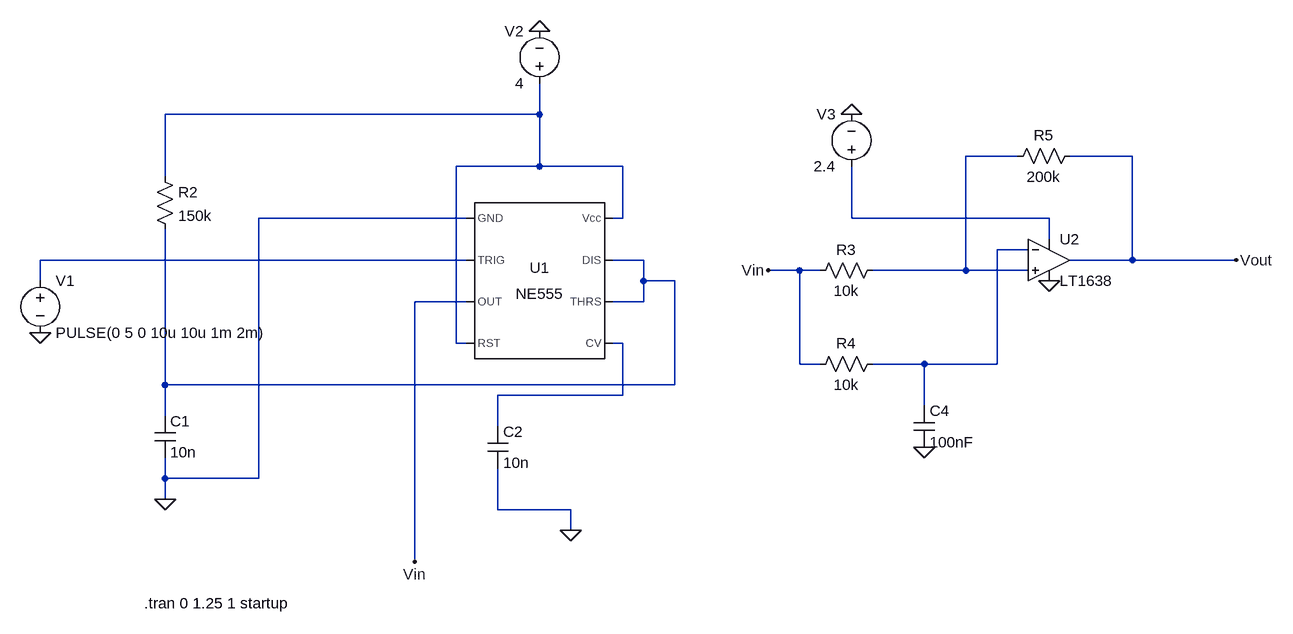
[diagram p0: schematic F to V using 555 Timer.asc]
F to V using 555 Timer.asc, the LTspice schematic file:
Version 4
SHEET 1 1368 804
WIRE 224 -80 224 -128
WIRE 224 -80 -352 -80
WIRE 960 -16 880 -16
WIRE 1136 -16 1040 -16
WIRE 224 0 224 -80
WIRE 224 0 96 0
WIRE 352 0 224 0
WIRE -352 16 -352 -80
WIRE 112 80 -208 80
WIRE 352 80 352 0
WIRE 352 80 336 80
WIRE 704 80 704 0
WIRE 1008 80 704 80
WIRE 1008 112 1008 80
WIRE 976 128 928 128
WIRE 112 144 -544 144
WIRE 384 144 336 144
WIRE 1136 144 1136 -16
WIRE 1136 144 1040 144
WIRE 1296 144 1136 144
WIRE 624 160 576 160
WIRE 656 160 624 160
WIRE 880 160 880 -16
WIRE 880 160 736 160
WIRE 976 160 880 160
WIRE -544 176 -544 144
WIRE 384 176 384 144
WIRE 432 176 384 176
WIRE 112 208 32 208
WIRE 384 208 384 176
WIRE 384 208 336 208
WIRE 96 272 96 0
WIRE 112 272 96 272
WIRE 352 272 336 272
WIRE 624 304 624 160
WIRE 656 304 624 304
WIRE 816 304 736 304
WIRE 928 304 928 128
WIRE 928 304 816 304
WIRE -352 336 -352 96
WIRE 432 336 432 176
WIRE 432 336 -352 336
WIRE 352 352 352 272
WIRE 352 352 160 352
WIRE 816 368 816 304
WIRE -352 384 -352 336
WIRE 160 400 160 352
WIRE -352 480 -352 448
WIRE -208 480 -208 80
WIRE -208 480 -352 480
WIRE -352 512 -352 480
WIRE 160 528 160 464
WIRE 272 528 160 528
WIRE 272 560 272 528
WIRE 32 608 32 208
FLAG 272 560 0
FLAG -352 512 0
FLAG -544 256 0
FLAG 224 -208 0
FLAG 816 432 0
FLAG 1008 176 0
FLAG 704 -80 0
FLAG 576 160 Vin
FLAG 32 608 Vin
FLAG 1296 144 Vout
SYMBOL Misc\\NE555 224 176 R0
SYMATTR InstName U1
SYMBOL res -368 0 R0
SYMATTR InstName R2
SYMATTR Value 150k
SYMBOL cap -368 384 R0
SYMATTR InstName C1
SYMATTR Value 10n
SYMBOL cap 144 400 R0
SYMATTR InstName C2
SYMATTR Value 10n
SYMBOL voltage -544 160 R0
WINDOW 123 0 0 Left 0
WINDOW 39 0 0 Left 0
SYMATTR InstName V1
SYMATTR Value PULSE(0 5 0 10u 10u 1m 2m)
SYMBOL voltage 224 -112 R180
WINDOW 0 24 96 Left 2
WINDOW 3 24 16 Left 2
WINDOW 123 0 0 Left 0
WINDOW 39 0 0 Left 0
SYMATTR InstName V2
SYMATTR Value 4
SYMBOL res 752 144 R90
WINDOW 0 0 56 VBottom 2
WINDOW 3 32 56 VTop 2
SYMATTR InstName R3
SYMATTR Value 10k
SYMBOL res 752 288 R90
WINDOW 0 0 56 VBottom 2
WINDOW 3 32 56 VTop 2
SYMATTR InstName R4
SYMATTR Value 10k
SYMBOL res 1056 -32 R90
WINDOW 0 0 56 VBottom 2
WINDOW 3 32 56 VTop 2
SYMATTR InstName R5
SYMATTR Value 200k
SYMBOL OpAmps\\LT1638 1008 80 R0
SYMATTR InstName U2
SYMBOL cap 800 368 R0
SYMATTR InstName C4
SYMATTR Value 100nF
SYMBOL voltage 704 16 R180
WINDOW 0 24 96 Left 2
WINDOW 3 24 16 Left 2
WINDOW 123 0 0 Left 0
WINDOW 39 0 0 Left 0
SYMATTR InstName V3
SYMATTR Value 2.4
TEXT -384 672 Left 2 !.tran 0 1.25 1 startup

The netlist it stands for:
* F to V using 555 Timer.asc
XU1 0 N005 Vin N001 N007 N006 N006 N001 NE555  ; pins GND TRIG OUT RST CV THRS DIS Vcc
R2 N001 N006 150k
C1 N006 0 10n
C2 N007 0 10n
V1 N005 0 PULSE(0 5 0 10u 10u 1m 2m)
V2 N001 0 4
R3 N002 Vin 10k
R4 N004 Vin 10k
R5 Vout N002 200k
XU2 N002 N004 N003 0 Vout LT1638  ; pins In+ In- V+ V- OUT
C4 N004 0 100nF
V3 N003 0 2.4
.tran 0 1.25 1 startup
.lib NE555.sub
.backanno
.end